# EAGLE design Side 1½ (EAGLE 8.5.1)
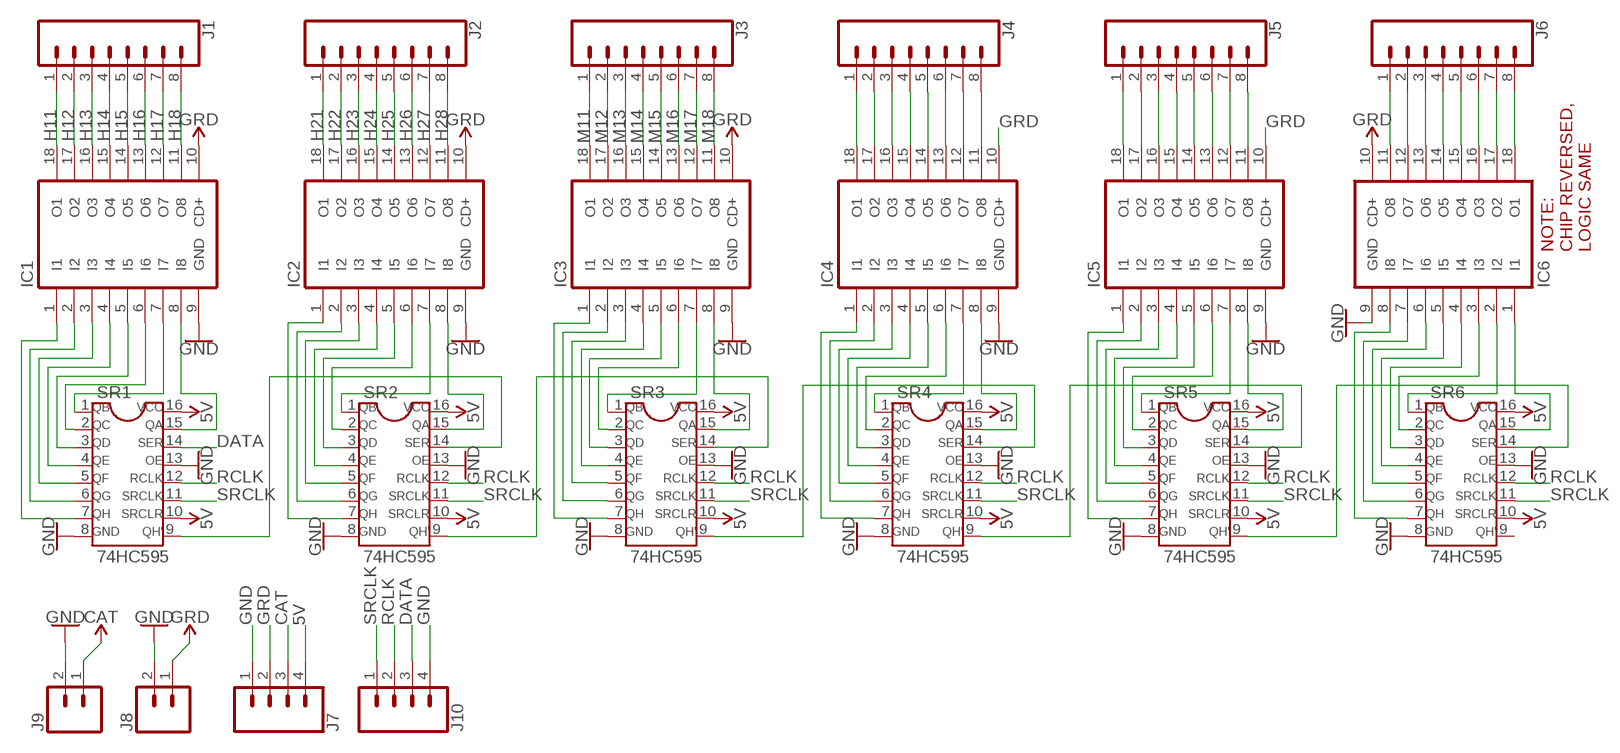
[diagram p0: schematic, sheet 1]

## Parts
IC1  ULN2802A  [DIL18]
IC2  ULN2802A  [DIL18]
IC3  ULN2802A  [DIL18]
IC4  ULN2802A  [DIL18]
IC5  ULN2802A  [DIL18]
IC6  ULN2802A  [DIL18]
J1  CONN_08"  [1X08]
J2  CONN_08"  [1X08]
J3  CONN_08"  [1X08]
J4  CONN_08"  [1X08]
J5  CONN_08"  [1X08]
J6  CONN_08"  [1X08]
J7  CONN_04  [1X04]
J8  CONN_02  [1X02]
J9  CONN_02  [1X02]
J10  CONN_04  [1X04]
SR1  74HC595  [DIL16]
SR2  74HC595  [DIL16]
SR3  74HC595  [DIL16]
SR4  74HC595  [DIL16]
SR5  74HC595  [DIL16]
SR6  74HC595  [DIL16]

## Nets
5V: J7.4 SR1.10(SRCLR) SR1.16(VCC) SR2.10(SRCLR) SR2.16(VCC) SR3.10(SRCLR) SR3.16(VCC) SR4.10(SRCLR) SR4.16(VCC) SR5.10(SRCLR) SR5.16(VCC) SR6.10(SRCLR) SR6.16(VCC)
CAT: J7.3 J9.1
DATA: J10.3 SR1.14(SER)
GND: IC1.9(GND) IC2.9(GND) IC3.9(GND) IC4.9(GND) IC5.9(GND) IC6.9(GND) J7.1 J8.2 J9.2 J10.4 SR1.8(GND) SR1.13(OE) SR2.8(GND) SR2.13(OE) SR3.8(GND) SR3.13(OE) SR4.8(GND) SR4.13(OE) SR5.8(GND) SR5.13(OE) SR6.8(GND) SR6.13(OE)
GRD: IC1.10(CD+) IC2.10(CD+) IC3.10(CD+) IC4.10(CD+) IC5.10(CD+) IC6.10(CD+) J7.2 J8.1
H11: IC1.18(O1) J1.1
H12: IC1.17(O2) J1.2
H13: IC1.16(O3) J1.3
H14: IC1.15(O4) J1.4
H15: IC1.14(O5) J1.5
H16: IC1.13(O6) J1.6
H17: IC1.12(O7) J1.7
H18: IC1.11(O8) J1.8
H21: IC2.18(O1) J2.1
H22: IC2.17(O2) J2.2
H23: IC2.16(O3) J2.3
H24: IC2.15(O4) J2.4
H25: IC2.14(O5) J2.5
H26: IC2.13(O6) J2.6
H27: IC2.12(O7) J2.7
H28: IC2.11(O8) J2.8
M11: IC3.18(O1) J3.1
M12: IC3.17(O2) J3.2
M13: IC3.16(O3) J3.3
M14: IC3.15(O4) J3.4
M15: IC3.14(O5) J3.5
M16: IC3.13(O6) J3.6
M17: IC3.12(O7) J3.7
M18: IC3.11(O8) J3.8
N$1: SR1.9(QH') SR2.14(SER)
N$2: SR2.9(QH') SR3.14(SER)
N$3: SR3.9(QH') SR4.14(SER)
N$4: SR4.9(QH') SR5.14(SER)
N$5: SR5.9(QH') SR6.14(SER)
N$6: IC3.8(I8) SR3.15(QA)
N$7: IC3.7(I7) SR3.1(QB)
N$8: IC3.6(I6) SR3.2(QC)
N$9: IC3.5(I5) SR3.3(QD)
N$10: IC3.4(I4) SR3.4(QE)
N$11: IC3.3(I3) SR3.5(QF)
N$12: IC3.2(I2) SR3.6(QG)
N$13: IC3.1(I1) SR3.7(QH)
N$14: IC2.8(I8) SR2.15(QA)
N$15: IC2.7(I7) SR2.1(QB)
N$16: IC2.6(I6) SR2.2(QC)
N$17: IC2.5(I5) SR2.3(QD)
N$18: IC2.4(I4) SR2.4(QE)
N$19: IC2.3(I3) SR2.5(QF)
N$20: IC2.2(I2) SR2.6(QG)
N$21: IC2.1(I1) SR2.7(QH)
N$22: IC1.8(I8) SR1.15(QA)
N$23: IC1.7(I7) SR1.1(QB)
N$24: IC1.6(I6) SR1.2(QC)
N$25: IC4.5(I5) SR4.3(QD)
N$26: IC1.5(I5) SR1.3(QD)
N$27: IC1.4(I4) SR1.4(QE)
N$28: IC1.3(I3) SR1.5(QF)
N$29: IC1.2(I2) SR1.6(QG)
N$30: IC1.1(I1) SR1.7(QH)
N$31: IC4.8(I8) SR4.15(QA)
N$32: IC4.7(I7) SR4.1(QB)
N$33: IC4.6(I6) SR4.2(QC)
N$34: IC4.4(I4) SR4.4(QE)
N$35: IC4.3(I3) SR4.5(QF)
N$36: IC4.2(I2) SR4.6(QG)
N$37: IC4.1(I1) SR4.7(QH)
N$38: IC5.8(I8) SR5.15(QA)
N$39: IC5.7(I7) SR5.1(QB)
N$40: IC5.6(I6) SR5.2(QC)
N$41: IC5.5(I5) SR5.3(QD)
N$42: IC5.4(I4) SR5.4(QE)
N$43: IC5.3(I3) SR5.5(QF)
N$44: IC5.2(I2) SR5.6(QG)
N$45: IC5.1(I1) SR5.7(QH)
N$46: IC6.1(I1) SR6.15(QA)
N$47: IC6.2(I2) SR6.1(QB)
N$48: IC6.3(I3) SR6.2(QC)
N$49: IC6.4(I4) SR6.3(QD)
N$50: IC6.5(I5) SR6.4(QE)
N$51: IC6.6(I6) SR6.5(QF)
N$52: IC6.7(I7) SR6.6(QG)
N$53: IC6.8(I8) SR6.7(QH)
N$54: IC6.11(O8) J6.1
N$55: IC6.12(O7) J6.2
N$56: IC6.13(O6) J6.3
N$57: IC6.14(O5) J6.4
N$58: IC6.15(O4) J6.5
N$59: IC6.16(O3) J6.6
N$60: IC6.17(O2) J6.7
N$61: IC6.18(O1) J6.8
N$62: IC5.18(O1) J5.1
N$63: IC5.17(O2) J5.2
N$64: IC5.16(O3) J5.3
N$65: IC5.15(O4) J5.4
N$66: IC5.14(O5) J5.5
N$67: IC5.13(O6) J5.6
N$68: IC5.12(O7) J5.7
N$69: IC5.11(O8) J5.8
N$70: IC4.18(O1) J4.1
N$71: IC4.17(O2) J4.2
N$72: IC4.16(O3) J4.3
N$73: IC4.15(O4) J4.4
N$74: IC4.14(O5) J4.5
N$75: IC4.13(O6) J4.6
N$76: IC4.12(O7) J4.7
N$77: IC4.11(O8) J4.8
RCLK: J10.2 SR1.12(RCLK) SR2.12(RCLK) SR3.12(RCLK) SR4.12(RCLK) SR5.12(RCLK) SR6.12(RCLK)
SRCLK: J10.1 SR1.11(SRCLK) SR2.11(SRCLK) SR3.11(SRCLK) SR4.11(SRCLK) SR5.11(SRCLK) SR6.11(SRCLK)
Unconnected: SR6.9(QH')

## Notes on the sheet
- NOTE: 
  CHIP REVERSED, 
  LOGIC SAME

## Library data of the parts
IC1-IC6 = uln-udn:ULN2802A: DRIVER ARRAY
J1-J6 = SparkFun-Connectors:CONN_08: Multi connection point. Often used as Generic Header-pin footprint for 0.1 inch spaced/style header connections On any of the 0.1 inch spaced packages, you can populate with these: Break Away Headers - Straight <https://www.sparkfun.com/products/116> (PRT-00116) Break Away Male Headers - Right Angle <https://www.sparkfun.com/products/553> (PRT-00553) Female Headers <https://www.sparkfun.com/products/115> (PRT-00115) Break Away Headers - Machine Pin <https://www.sparkfun.com/products/117> (PRT-00117) Break Away Female Headers - Swiss Machine Pin <https://www.sparkfun.com/products/743> (PRT-00743) Arduino Stackable Header - 8 Pin <https://www.sparkfun.com/products/9279> (PRT-09279) For SCREWTERMINALS and SPRING TERMINALS visit here: Screw Terimnals on SparkFun.com <https://www.sparkfun.com/search/results?term=Screw+Terminals> (5mm/3.5mm/2.54mm spacing) This device is also useful as a general connection point to wire up your design to another part of your project. Our various solder wires solder well into these plated through hole pads. Hook-Up Wire - Assortment (Stranded, 22 AWG) <https://www.sparkfun.com/products/11375> (PRT-11375) Hook-Up Wire - Assortment (Solid Core, 22 AWG) <https://www.sparkfun.com/products/11367> (PRT-11367) View the entire wire category on our website here <https://www.sparkfun.com/categories/141> Special notes: Molex polarized connector foot print use with SKU : PRT-08231 with associated crimp pins and housings. 1MM SMD Version SKU: PRT-10208 NOTES ON THE VARIANTS LOCK and LOCK_LONGPADS... This footprint was designed to help hold the alignment of a through-hole component (i.e. 6-pin header) while soldering it into place. You may notice that each hole has been shifted either up or down by 0.005 of an inch from it's more standard position (which is a perfectly straight line). This slight alteration caused the pins (the squares in the middle) to touch the edges of the holes. Because they are alternating, it causes a "brace" to hold the component in place. 0.005 has proven to be the perfect amount of "off-center" position when using our standard breakaway headers. Although looks a little odd when you look at the bare footprint, once you have a header in there, the alteration is very hard to notice. Also,if you push a header all the way into place, it is covered up entirely on the bottom side.; PROD_ID: CONN-08438
J7 J10 = SparkFun-Connectors:CONN_04: Multi connection point. Often used as Generic Header-pin footprint for 0.1 inch spaced/style header connections On any of the 0.1 inch spaced packages, you can populate with these: Break Away Headers - Straight <https://www.sparkfun.com/products/116> (PRT-00116) Break Away Male Headers - Right Angle <https://www.sparkfun.com/products/553> (PRT-00553) Female Headers <https://www.sparkfun.com/products/115> (PRT-00115) Break Away Headers - Machine Pin <https://www.sparkfun.com/products/117> (PRT-00117) Break Away Female Headers - Swiss Machine Pin <https://www.sparkfun.com/products/743> (PRT-00743) For SCREWTERMINALS and SPRING TERMINALS visit here: Screw Terimnals on SparkFun.com <https://www.sparkfun.com/search/results?term=Screw+Terminals> (5mm/3.5mm/2.54mm spacing) This device is also useful as a general connection point to wire up your design to another part of your project. Our various solder wires solder well into these plated through hole pads. Hook-Up Wire - Assortment (Stranded, 22 AWG) <https://www.sparkfun.com/products/11375> (PRT-11375) Hook-Up Wire - Assortment (Solid Core, 22 AWG) <https://www.sparkfun.com/products/11367> (PRT-11367) View the entire wire category on our website here <https://www.sparkfun.com/categories/141> Special notes: Molex polarized connector foot print use with SKU : PRT-08231 with associated crimp pins and housings. 1MM SMD Version SKU: PRT-10208; PROD_ID: CONN-09696
J8 J9 = SparkFun-Connectors:CONN_02: Multi connection point. Often used as Generic Header-pin footprint for 0.1 inch spaced/style header connections On any of the 0.1 inch spaced packages, you can populate with these: Break Away Headers - Straight <https://www.sparkfun.com/products/116> (PRT-00116) Break Away Male Headers - Right Angle <https://www.sparkfun.com/products/553> (PRT-00553) Female Headers <https://www.sparkfun.com/products/115> (PRT-00115) Break Away Headers - Machine Pin <https://www.sparkfun.com/products/117> (PRT-00117) Break Away Female Headers - Swiss Machine Pin <https://www.sparkfun.com/products/743> (PRT-00743) For SCREWTERMINALS and SPRING TERMINALS visit here: Screw Terimnals on SparkFun.com <https://www.sparkfun.com/search/results?term=Screw+Terminals> (5mm/3.5mm/2.54mm spacing) This device is also useful as a general connection point to wire up your design to another part of your project. Our various solder wires solder well into these plated through hole pads. Hook-Up Wire - Assortment (Stranded, 22 AWG) <https://www.sparkfun.com/products/11375> (PRT-11375) Hook-Up Wire - Assortment (Solid Core, 22 AWG) <https://www.sparkfun.com/products/11367> (PRT-11367) View the entire wire category on our website here <https://www.sparkfun.com/categories/141> Special notes: Molex polarized connector foot print use with: PRT-08233 with associated crimp pins and housings. 2.54_SCREWTERM for use with PRT-10571. 3.5mm Screw Terminal footprints for PRT-08084 5mm Screw Terminal footprints for use with PRT-08432
SR1-SR6 = Clock components:74HC595

## Board
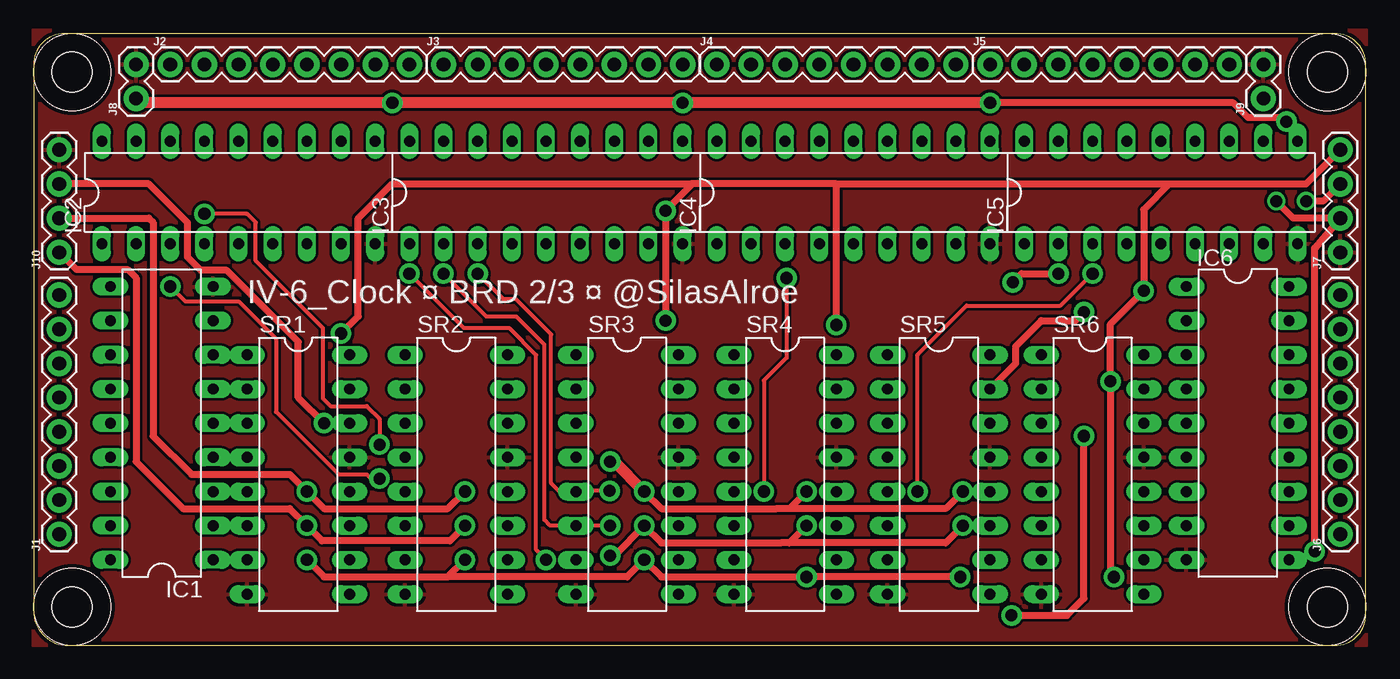
[diagram p1: board, top side]
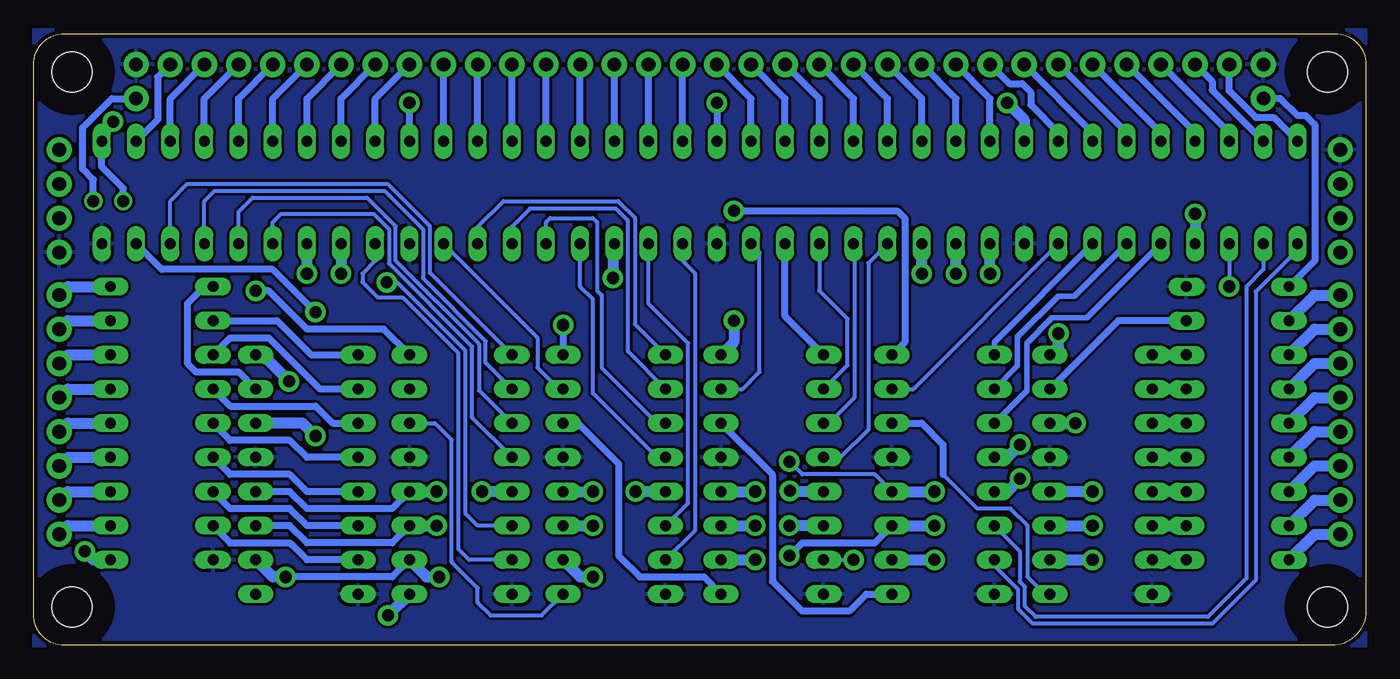
[diagram p2: board, bottom side, seen from below]

Size 99.06 x 45.47 mm. Coordinates in mm from the lower left corner, seen from the top.
Outline: 2.54,0 96.77,0 arc90 99.06,2.29 99.06,43.18 arc90 96.77,45.47 2.29,45.47 arc90 0,43.18 0,2.54 arc90 2.54,0
Copper layers (1*16): Top 0.035mm / dielectric 1.5mm / Bottom 0.035mm
Design rules "default *": minimum track width 6mil, minimum drill 0.35mm, track to track 8mil, track to pad 8mil, pad to pad 8mil, via to via 8mil, smd to smd 8mil, copper to edge 12mil, drill to drill 12mil, minimum pad ring 10mil, minimum via ring 8mil, stop-mask expansion 4mil, vias tented up to drill 0mil, thermal gap 10mil
Holes 3 mm at 2.86,2.86 2.86,42.61 96.2,42.61 96.2,2.86
tRestrict: area 1,1 to 4.8,4.8; area 94.3,1 to 98.1,4.8; area 1,40.7 to 4.8,44.5; area 94.3,40.7 to 98.1,44.5
bRestrict: area 1,1 to 4.8,4.8; area 1,40.7 to 4.8,44.5; area 94.3,40.7 to 98.1,44.5; area 94.3,1 to 98.1,4.8

### Footprints (pad centres in the part's own frame; a part is rotated, then mirrored left to right if it is on the bottom)
DIL18 = drill 0.813 long: 1 -10.16,-3.81; 2 -7.62,-3.81; 3 -5.08,-3.81; 4 -2.54,-3.81; 5 0,-3.81; 6 2.54,-3.81; 7 5.08,-3.81; 8 7.62,-3.81; 9 10.16,-3.81; 10 10.16,3.81; 11 7.62,3.81; 12 5.08,3.81; 13 2.54,3.81; 14 0,3.81; 15 -2.54,3.81; 16 -5.08,3.81; 17 -7.62,3.81; 18 -10.16,3.81
1X08 = drill 1.016 pad 1.88: 1 0,0; 2 2.54,0; 3 5.08,0; 4 7.62,0; 5 10.16,0; 6 12.7,0; 7 15.24,0; 8 17.78,0
1X04 = drill 1.016 pad 1.88: 1 0,0; 2 2.54,0; 3 5.08,0; 4 7.62,0
1X02 = drill 1.016 pad 1.88: 1 0,0; 2 2.54,0
DIL16 = drill 0.813 long: 1 -8.89,-3.81; 2 -6.35,-3.81; 3 -3.81,-3.81; 4 -1.27,-3.81; 5 1.27,-3.81; 6 3.81,-3.81; 7 6.35,-3.81; 8 8.89,-3.81; 9 8.89,3.81; 10 6.35,3.81; 11 3.81,3.81; 12 1.27,3.81; 13 -1.27,3.81; 14 -3.81,3.81; 15 -6.35,3.81; 16 -8.89,3.81

### Placement (x,y rotation side)
IC1  9.53,16.51 90 top
IC2  15.24,33.66 0 top
IC3  38.1,33.66 0 top
IC4  60.96,33.66 0 top
IC5  83.82,33.66 0 top
IC6  89.53,16.51 270 top
J1  1.91,8.26 90 top
J2  10.16,43.18 0 top
J3  30.48,43.18 0 top
J4  50.8,43.18 0 top
J5  71.12,43.18 0 top
J6  97.16,8.26 90 top
J7  97.16,29.21 90 top
J8  7.62,40.64 90 top
J9  91.44,40.64 90 top
J10  1.91,29.21 90 top
SR1  19.68,12.7 270 top
SR2  31.43,12.7 270 top
SR3  44.13,12.7 270 top
SR4  55.88,12.7 270 top
SR5  67.31,12.7 270 top
SR6  78.74,12.7 270 top

### Tracks (layer width: path | path; a pad name or v marks a point on that pad's centre or on a via)
5V  (via drill 0.9 pad 1.52)
  Top 0.508: J7.4 94.61,34.29 84.45,34.29 | 84.45,34.29 82.55,32.38 v82.55,26.35 80.07,23.87 v80.07,19.63 80.07,5.34 v80.33,5.08 | v59.69,23.81 59.69,34.29 | 59.69,34.29 84.45,34.29 | 59.69,34.29 48.9,34.29 | v46.99,32.3 v46.99,24.13 | 48.9,34.29 26.67,34.29 24.13,31.75 24.13,24.45 v22.86,23.18 | v20.32,6.35 21.59,5.08 30.8,5.08 | v32.07,6.35 30.8,5.08 | 30.8,5.08 44.13,5.08 v45.4,6.35 46.67,5.08 v57.47,5.08 v68.9,5.08 | v46.99,32.3 47.22,32.3 | v46.99,32.3 48.9,34.2 48.9,34.29
  Bottom 0.508: v59.69,23.81 SR4.16 | SR5.16 73.03,23.5 78.74,23.5 81.6,26.35 v82.55,26.35 | SR2.16 34.29,22.54 34.29,31.75 34.84,32.3 v46.99,32.3 | SR5.10 72.39,5.08 v80.33,5.08 | 82.48,6.28 SR6.10
  Bottom 0.813: SR3.16 46.99,22.54 v46.99,24.13 | SR1.16 22.86,22.23 v22.86,23.18 | SR6.10 81.28,5.08 v80.33,5.08 | SR1.10 v20.32,6.35 | SR2.10 v32.07,6.35 | SR3.10 v45.4,6.35 | SR4.10 58.42,5.08 v57.47,5.08 | SR5.10 69.85,5.08 v68.9,5.08 | SR6.16 82.03,21.59 v80.07,19.63
CAT  (via drill 0.9)
  Top 0.508: J7.3 95.89,33.02 v94.61,33.02
  Bottom 0.508: J9.1 93.25,40.64 95.42,38.48 95.42,35.41 94.61,34.61 v94.61,33.02
DATA  (via drill 0.9 pad 1.52)
  Top 0.508: v21.59,16.51 19.68,18.41 19.68,22.56 14.37,27.88 12.43,27.88 11.43,28.87 11.43,31.43 8.57,34.29 J10.3
  Bottom 0.813: SR1.14 v21.59,16.51
GND
  Top 0.305: 15.93,3.38 SR1.8
  Bottom 0.305: 7.48,42.95 J8.2
  pour Top: 0,0 0,45.72 99.06,45.72 99.06,0
  pour Bottom: 0,0 0,45.72 99.06,45.72 99.06,0
  pour Bottom (no thermals): 11.43,35.56 55.24,35.56 55.88,34.92 55.88,33.66 12.06,33.66 11.43,34.29
GRD  (via drill 0.9, 0.9 pad 1.52)
  Top 0.305: 97,31.85 J7.2 | 48.26,37.4 IC3.10
  Top 0.508: v95.25,6.99 95.25,29.53 J7.2 93.66,31.75 v92.39,33.02 | v71.12,40.32 89.22,40.32 90.3,39.24 92.84,39.24 v93.15,38.92
  Top 0.813: v71.12,40.32 v48.26,40.32 v26.67,40.32 7.94,40.32 J8.1
  Bottom 0.508: J8.1 6.35,40.64 5.08,39.37 4.47,39.37 3.83,38.73 3.81,38.73 3.81,28.57 IC1.10 | IC4.10 v71.12,40.32 | v48.26,40.32 IC3.10 | v93.15,38.92 93.98,38.1 IC5.10 93.98,35.56 92.39,33.97 v92.39,33.02
  Bottom 0.813: v26.67,40.32 25.4,39.05 IC2.10 | IC6.10 94.61,6.35 v95.25,6.99
H11
  Bottom 0.813: IC1.18 3.81,8.26 J1.1
H12
  Bottom 0.813: IC1.17 3.81,10.79 J1.2
H13
  Bottom 0.813: IC1.16 3.81,13.34 J1.3
H14
  Bottom 0.813: IC1.15 3.81,15.88 J1.4
H15
  Bottom 0.813: IC1.14 3.81,18.41 J1.5
H16
  Bottom 0.813: IC1.13 3.81,20.95 J1.6
H17
  Bottom 0.813: IC1.12 3.81,23.5 J1.7
H18
  Bottom 0.813: IC1.11 3.81,26.04 J1.8
H21
  Bottom 0.508: J2.1 10.16,41.2 8.2,39.24 6.86,39.24 IC2.18
H22
  Bottom 0.508: IC2.17 11.43,41.27 11.43,41.91 J2.2
H23
  Bottom 0.508: J2.3 10.16,38.1 IC2.16
H24
  Bottom 0.508: J2.4 12.7,38.1 IC2.15
H25
  Bottom 0.508: J2.5 15.24,38.1 IC2.14
H26
  Bottom 0.508: J2.6 17.78,38.1 IC2.13
H27
  Bottom 0.508: J2.7 20.32,38.1 IC2.12
H28
  Bottom 0.508: J2.8 26.51,41.75 25.56,41.75 24.92,41.12 24.92,40.16 22.86,38.1 IC2.11
M11
  Bottom 0.508: IC3.18 27.94,40.64 J3.1
M12
  Bottom 0.508: IC3.17 30.48,40.64 J3.2
M13
  Bottom 0.508: IC3.16 33.02,40.64 J3.3
M14
  Bottom 0.508: IC3.15 35.56,40.64 J3.4
M15
  Bottom 0.508: IC3.14 38.1,40.64 J3.5
M16
  Bottom 0.508: IC3.13 40.64,40.64 J3.6
M17
  Bottom 0.508: IC3.12 43.18,40.64 J3.7
M18
  Bottom 0.508: IC3.11 45.72,40.64 J3.8
N$1
  Bottom 0.305: 31.43,12.7 28.89,10.16 26.42,10.16 25.17,8.91 25.17,5.11 23.88,3.81 SR1.9
  Bottom 0.508: SR2.14 33.02,16.51 31.43,14.92 31.43,12.7
N$2
  Bottom 0.508: SR2.9 37.15,3.81 38.42,2.54 41.91,2.54 44.13,4.76 44.13,12.7 SR3.14
N$3
  Bottom 0.508: SR3.9 49.21,5.08 53.98,5.08 55.56,6.67 55.56,13.49 58.58,16.51 SR4.14
N$4
  Bottom 0.305: SR4.9 61.28,2.22 65.09,2.22 66.04,3.17 66.04,4.25 67.98,6.19 67.98,15.27 69.22,16.51 SR5.14
N$5  (via drill 0.9 pad 1.52)
  Top 0.508: v72.71,2.22 76.83,2.22 78.11,3.49 v78.11,15.56
  Bottom 0.813: v78.11,15.56 79.06,16.51 SR6.14 | SR5.9 v72.71,2.22
N$6
  Bottom 0.305: IC3.8 45.09,29.21 45.09,20.32 46.35,19.05 SR3.15
N$7
  Bottom 0.508: SR3.1 43.18,24.45 IC3.7
N$8
  Bottom 0.305: IC3.6 40.64,26.35 38.54,24.26 38.54,20.83 SR3.2
N$9
  Bottom 0.305: IC3.5 38.04,29.78 38.04,18.41 39.94,16.51 SR3.3
N$10
  Bottom 0.305: IC3.4 36.99,28.42 36.99,16.03 39.05,13.97 SR3.4
N$11  (via drill 0.9 pad 1.52)
  Top 0.305: SR3.5 39.12,11.43 | 39.12,11.43 38.49,12.06 38.49,23.11 35.88,25.72 34.92,25.72 v33.02,27.62 | v42.83,11.48 39.17,11.48 39.12,11.43
  Bottom 0.508: 42.77,11.43 v42.83,11.48
  Bottom 0.813: v33.02,27.62 IC3.3 | SR3.5 42.77,11.43
N$12  (via drill 0.9 pad 1.52)
  Top 0.305: 37.98,13.06 37.98,13.34 | 37.98,13.34 37.98,22.35 35.88,24.45 33.66,24.45 v30.48,27.62 | 37.98,13.34 37.98,13.33 37.98,9.33 38.42,8.89 v42.86,8.89
  Bottom 0.813: v30.48,27.62 IC3.2 | SR3.6 v42.86,8.89
N$13  (via drill 0.9 pad 1.52)
  Top 0.305: v38.1,6.35 37.36,7.09 37.36,21.57 35.34,23.59 31.97,23.59 v27.94,27.62
  Bottom 0.305: SR3.7 v38.1,6.35
  Bottom 0.813: v27.94,27.62 IC3.1
N$14
  Bottom 0.305: SR2.15 33.66,19.05 IC2.8
N$15
  Bottom 0.406: IC2.7 27.62,22.54 SR2.1
N$16
  Bottom 0.406: IC2.6 21.67,25.96 22.86,25.96 25.89,22.93 25.89,20.78 SR2.2
N$17
  Bottom 0.406: SR2.3 25.22,18.91 25.22,22.47 23.34,24.35 20.74,24.35 IC2.5
N$18  (via drill 0.9 pad 1.52)
  Top 0.305: v25.72,14.92 25.72,16.83 24.77,17.78 22.07,17.78 21.51,18.34 21.51,23.57 16.51,28.57 16.51,31.43 15.88,32.07 v12.7,32.07
  Bottom 0.813: SR2.4 26.67,13.97 v25.72,14.92 | v12.7,32.07 IC2.4
N$19  (via drill 0.9 pad 1.52)
  Top 0.305: v10.16,26.67 11.27,25.56 15.24,25.56 18.02,22.78 18.02,17.35 22.67,12.7 24.77,12.7 25.08,12.38 v25.72,12.38
  Bottom 0.305: IC2.3 v10.16,26.67
  Bottom 0.813: SR2.5 26.67,11.43 v25.72,12.38
N$20
  Bottom 0.305: IC2.2 7.62,27.94 8.89,26.67 8.89,4.97 11.75,2.12 24.55,2.12 25.34,2.9 25.34,4.34 25.74,4.74 25.74,7 SR2.6
N$21
  Bottom 0.305: SR2.7 27.62,5.87 27.58,5.87 25.84,4.13 25.84,2.69 24.77,1.61 11.41,1.61 8.19,4.83 8.19,26.29 5.08,29.4 IC2.1
N$22
  Bottom 0.508: IC1.8 18.41,24.13 SR1.15
N$23
  Bottom 0.813: SR1.1 IC1.7
N$24
  Bottom 0.813: IC1.6 SR1.2
N$25
  Bottom 0.305: SR4.3 52.7,16.51 56.83,20.64 56.83,26.04 57.15,26.35 57.15,31.43 57.47,31.75 60.64,31.75 60.96,31.43 IC4.5
N$26
  Bottom 0.813: IC1.5 SR1.3
N$27
  Bottom 0.813: IC1.4 SR1.4
N$28
  Bottom 0.813: IC1.3 SR1.5
N$29
  Bottom 0.813: SR1.6 IC1.2
N$30
  Bottom 0.813: SR1.7 IC1.1
N$31
  Bottom 0.305: SR4.15 60.01,19.05 61.59,20.64 61.59,22.86 IC4.8
N$32
  Bottom 0.305: SR4.1 54.36,23.88 54.36,31.77 55.6,33.02 64.14,33.02 66.04,31.11 IC4.7
N$33
  Bottom 0.305: SR4.2 54.86,21.84 54.86,31.57 55.76,32.46 62.16,32.46 63.5,31.11 IC4.6
N$34
  Bottom 0.305: SR4.4 52.7,13.97 57.47,18.73 57.47,25.72 58.42,26.67 IC4.4
N$35  (via drill 0.9 pad 1.52)
  Top 0.305: v54.29,11.43 54.29,19.68 55.98,21.37 v55.98,27.3
  Bottom 0.305: IC4.3 55.98,29.74
  Bottom 0.813: SR4.5 v54.29,11.43 | 55.98,29.74 v55.98,27.3
N$36
  Bottom 0.305: IC4.2 53.34,25.4 50.39,22.45 50.39,10.57 SR4.6
N$37
  Bottom 0.305: IC4.1 50.8,28.57 49.89,27.66 49.89,8.53 SR4.7
N$38  (via drill 0.9 pad 1.52)
  Top 0.508: SR5.15 73.03,20.95 73.03,22.23 74.93,24.13 77.47,24.13 v78.11,24.77
  Bottom 0.508: IC5.8 89.53,27.94 81.28,27.94 v78.11,24.77
N$39
  Bottom 0.305: SR5.1 69.6,27.69 69.6,31.14 72.75,34.29 87.63,34.29 88.9,33.02 IC5.7
N$40
  Bottom 0.305: SR5.2 65.44,20.99 65.44,22.62 70.1,27.29 70.1,30.93 72.96,33.78 85.6,33.78 86.36,33.02 IC5.6
N$41
  Bottom 0.305: SR5.3 65.94,18.95 65.94,22.41 72.14,28.6 72.14,31.14 72.89,31.89 74.27,33.27 82.77,33.27 83.82,32.22 IC5.5
N$42
  Bottom 0.305: SR5.4 66.45,16.92 66.45,22.2 72.64,28.39 72.64,30.93 73.78,32.07 80.64,32.07 81.28,31.43 IC5.4
N$43  (via drill 0.9 pad 1.52)
  Top 0.305: v78.74,27.62 76.36,25.24 69.37,25.24 65.72,21.59 v65.72,11.43
  Bottom 0.813: SR5.5 v65.72,11.43 | v78.74,27.62 IC5.3
N$44  (via drill 0.9 pad 1.52)
  Top 0.508: v72.81,26.97 73.46,27.62 v76.2,27.62
  Bottom 0.305: SR5.6 66.04,8.89 66.96,9.81 66.96,21.92 72.02,26.97 v72.81,26.97
  Bottom 0.813: IC5.2 v76.2,27.62
N$45
  Bottom 0.305: SR5.7 66.67,6.35 67.47,7.14 67.47,21.71 71.62,25.86 73.48,25.86 74.61,26.99 74.61,27.62 73.66,28.57 IC5.1
N$46
  Bottom 0.508: IC6.1 86.36,26.67 87.63,25.4 87.63,20.95 87,20.32 83.82,20.32 SR6.15
N$47
  Bottom 0.508: SR6.1 78.42,21.59 80.96,24.13 IC6.2
N$48
  Bottom 0.508: SR6.2 77.77,19.05 81.58,22.86 84.45,22.86 IC6.3
N$49
  Bottom 0.508: IC6.4 84.45,17.78 78.11,17.78 76.83,16.51 SR6.3
N$50
  Bottom 0.508: SR6.4 78.74,13.97 80.01,15.24 84.45,15.24 IC6.5
N$51
  Bottom 0.508: IC6.6 84.45,12.7 80.01,12.7 78.74,11.43 SR6.5
N$52
  Bottom 0.508: IC6.7 84.45,10.16 80.01,10.16 78.74,8.89 SR6.6
N$53
  Bottom 0.508: IC6.8 84.45,7.62 80.01,7.62 79.85,7.46 78.74,6.35 SR6.7
N$54
  Bottom 0.813: J6.1 96.52,8.89 IC6.11
N$55
  Bottom 0.813: J6.2 96.52,11.43 IC6.12
N$56
  Bottom 0.813: J6.3 96.52,13.97 IC6.13
N$57
  Bottom 0.813: J6.4 96.52,16.51 IC6.14
N$58
  Bottom 0.813: J6.5 96.52,19.05 IC6.15
N$59
  Bottom 0.813: J6.6 96.52,21.59 IC6.16
N$60
  Bottom 0.813: J6.7 96.52,24.13 IC6.17
N$61
  Bottom 0.813: J6.8 96.52,26.67 IC6.18
N$62
  Bottom 0.508: IC5.18 73.66,40.64 J5.1
N$63
  Bottom 0.508: IC5.17 76.2,40.64 J5.2
N$64
  Bottom 0.508: IC5.16 78.74,40.64 J5.3
N$65
  Bottom 0.508: IC5.15 81.28,40.64 J5.4
N$66
  Bottom 0.508: IC5.14 83.82,40.64 J5.5
N$67
  Bottom 0.508: IC5.13 86.36,40.64 J5.6
N$68
  Bottom 0.508: IC5.12 88.9,40.64 J5.7
N$69
  Bottom 0.508: IC5.11 89.85,39.05 89.85,42.23 J5.8
N$70
  Bottom 0.508: IC4.18 J4.1
N$71
  Bottom 0.508: IC4.17 J4.2
N$72
  Bottom 0.508: IC4.16 J4.3
N$73
  Bottom 0.508: IC4.15 J4.4
N$74
  Bottom 0.508: IC4.14 J4.5
N$75
  Bottom 0.508: IC4.13 J4.6
N$76
  Bottom 0.508: IC4.12 J4.7
N$77
  Bottom 0.508: IC4.11 J4.8
RCLK  (via drill 0.9 pad 1.52)
  Top 0.305: 55.24,10.16 55.56,10.16
  Top 0.508: J10.2 8.57,31.75 8.89,31.43 8.89,15.56 11.75,12.7 19.05,12.7 v20.32,11.43 21.59,10.16 30.8,10.16 v32.07,11.43 | v45.4,11.43 46.67,10.16 55.24,10.16 56.2,10.16 | v57.47,11.43 56.2,10.16 | v69.09,11.43 67.82,10.16 56.2,10.16
  Top 0.813: v45.4,11.43 43.18,13.65 v42.86,13.65
  Bottom 0.305: v42.86,13.65 41.91,12.7 36.51,12.7 SR2.12
  Bottom 0.508: SR5.12 72.39,10.16 78.74,10.16 80.01,11.43 SR6.12
  Bottom 0.813: v20.32,11.43 SR1.12 | SR2.12 v32.07,11.43 | SR3.12 v45.4,11.43 | SR4.12 v57.47,11.43 | SR5.12 v69.09,11.43
SRCLK  (via drill 0.9 pad 1.52)
  Top 0.305: 55.56,7.62 55.88,7.62
  Top 0.508: J10.1 3.17,27.94 6.99,27.94 7.62,27.3 7.62,13.65 11.11,10.16 19.05,10.16 v20.32,8.89 21.44,7.77 30.95,7.77 v32.07,8.89 | v42.86,6.67 43.18,6.67 v45.4,8.89 46.67,7.62 55.56,7.62 56.2,7.62 | v57.47,8.89 56.2,7.62 | v69.09,8.89 67.82,7.62 56.2,7.62
  Bottom 0.508: SR5.11 72.39,7.62 78.74,7.62 80.01,8.89 SR6.11 | SR2.11 36.51,7.62 41.91,7.62 v42.86,6.67
  Bottom 0.813: SR1.11 v20.32,8.89 | SR2.11 v32.07,8.89 | SR3.11 v45.4,8.89 | SR4.11 v57.47,8.89 | SR5.11 v69.09,8.89

### Text on the board
tNames: IV-6_Clock ¤ BRD 2/3 ¤ @SilasAlroe
bRestrict: IV-6_Clock ¤ BRD 2/3 ¤ @SilasAlroe